# Altium schematic sheet Serializer_System.SchDoc
size A
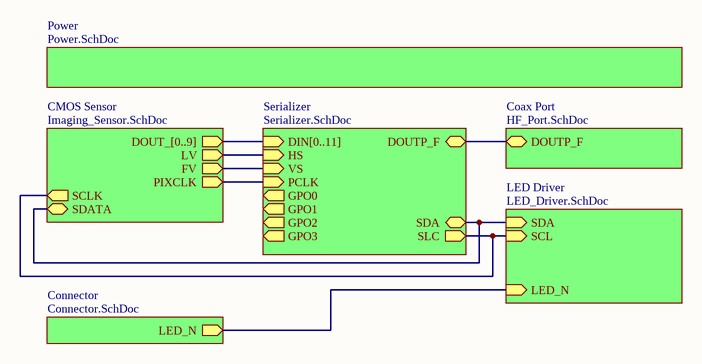
[diagram p0: Serializer_System.SchDoc]

## Sub-sheets
CMOS Sensor = Imaging_Sensor.SchDoc: DOUT_[0..9] (out), LV (out), FV (out), PIXCLK (out), SCLK (out), SDATA (bidir)
Coax Port = HF_Port.SchDoc: DOUTP_F (bidir)
Connector = Connector.SchDoc: LED_N (out)
LED Driver = LED_Driver.SchDoc: SCL (in), SDA (in), LED_N (in)
Power = Power.SchDoc: no entries
Serializer = Serializer.SchDoc: DIN[0..11] (in), HS (in), VS (in), PCLK (in), DOUTP_F (bidir), SDA (bidir), SLC (out), GPO0 (out), GPO1 (out), GPO2 (out), GPO3 (out)

## Nets
(unnamed): sheet Serializer/HS, sheet CMOS Sensor/LV
(unnamed): sheet Serializer/VS, sheet CMOS Sensor/FV
(unnamed): sheet Serializer/PCLK, sheet CMOS Sensor/PIXCLK
(unnamed): sheet Serializer/DOUTP_F, sheet Coax Port/DOUTP_F
(unnamed): sheet Serializer/SDA, sheet LED Driver/SDA, sheet CMOS Sensor/SDATA
(unnamed): sheet Serializer/SLC, sheet LED Driver/SCL, sheet CMOS Sensor/SCLK
(unnamed): sheet LED Driver/LED_N, sheet Connector/LED_N

## Buses and harness runs
bus sheet CMOS Sensor/DOUT_[0..9] = sheet Serializer/DIN[0..11]